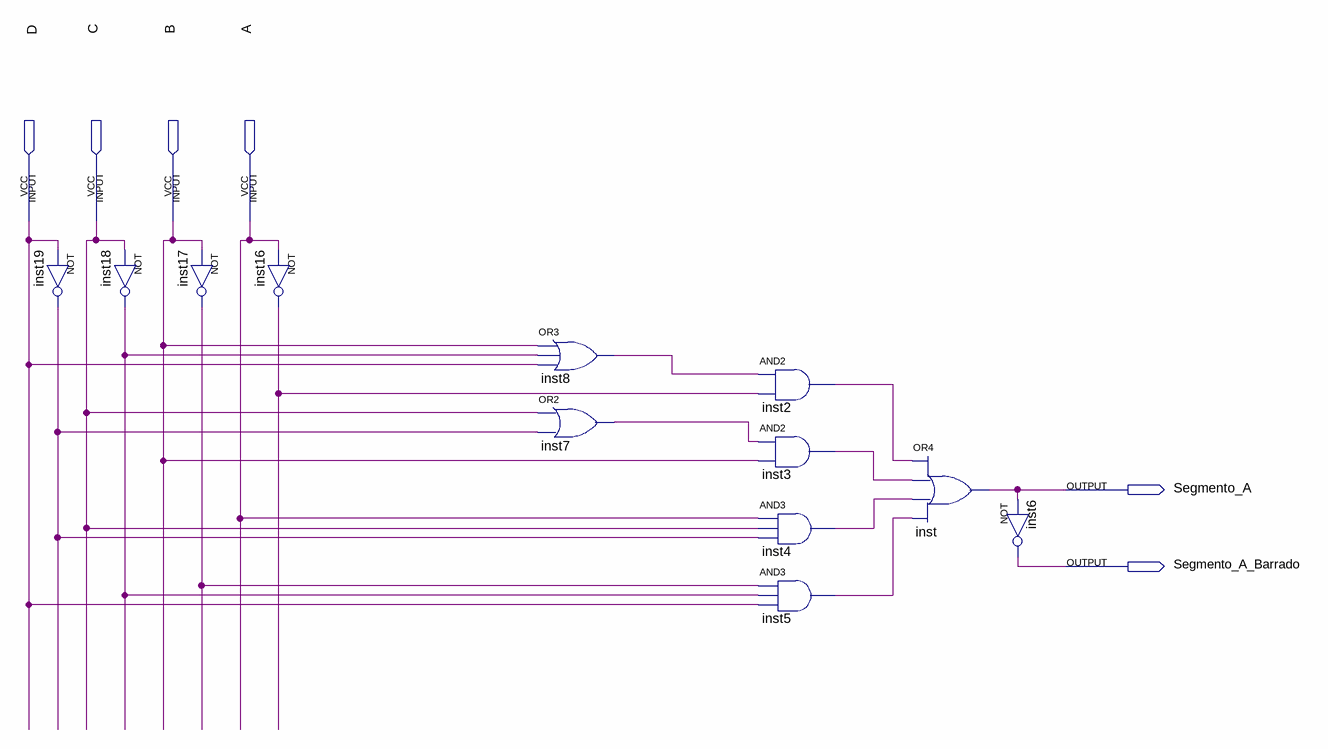
[diagram p0: schematic sheet]
// Quartus schematic SEG_A.bdf as structural Verilog: 12 symbols, 6 pins
module SEG_A (
  input  D,
  input  C,
  input  B,
  input  A,
  output Segmento_A,
  output Segmento_A_Barrado
);

  wire inst2_out, inst3_out, inst4_out, inst5_out, inst7_out, inst8_out, inst16_out, inst17_out, inst18_out,
       inst19_out;

  not inst19 (inst19_out, D);
  not inst18 (inst18_out, C);
  not inst17 (inst17_out, B);
  not inst16 (inst16_out, A);
  or inst8 (inst8_out, B, inst18_out, D);
  or inst7 (inst7_out, C, inst19_out);
  and inst2 (inst2_out, inst8_out, inst16_out);
  and inst3 (inst3_out, inst7_out, B);
  and inst4 (inst4_out, A, C, inst19_out);
  and inst5 (inst5_out, inst17_out, inst18_out, D);
  or inst (Segmento_A, inst2_out, inst3_out, inst4_out, inst5_out);
  not inst6 (Segmento_A_Barrado, Segmento_A);
endmodule
